# EAGLE design main (EAGLE 5.09)
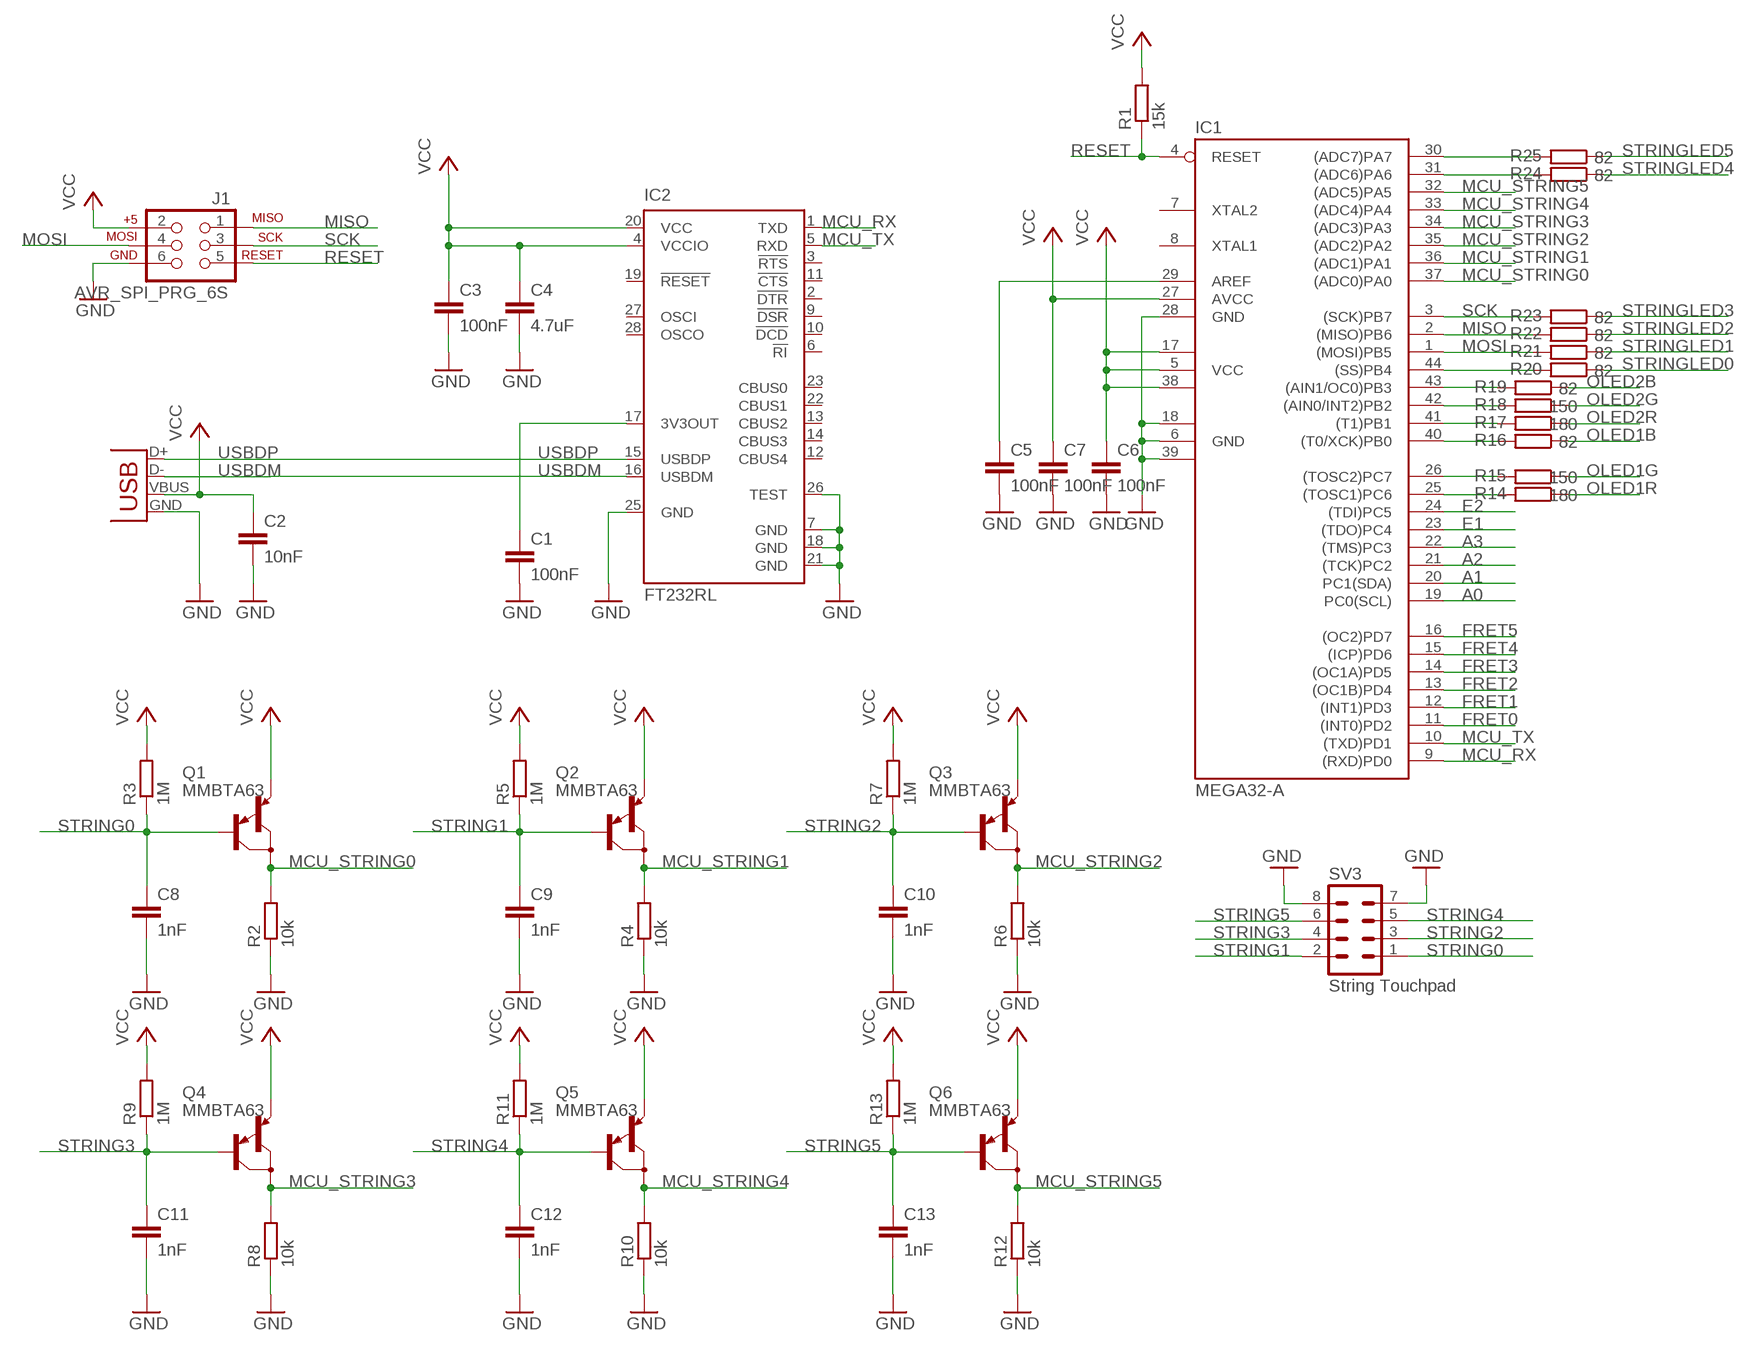
[diagram p0: schematic, sheet 1, part 1 of 2]
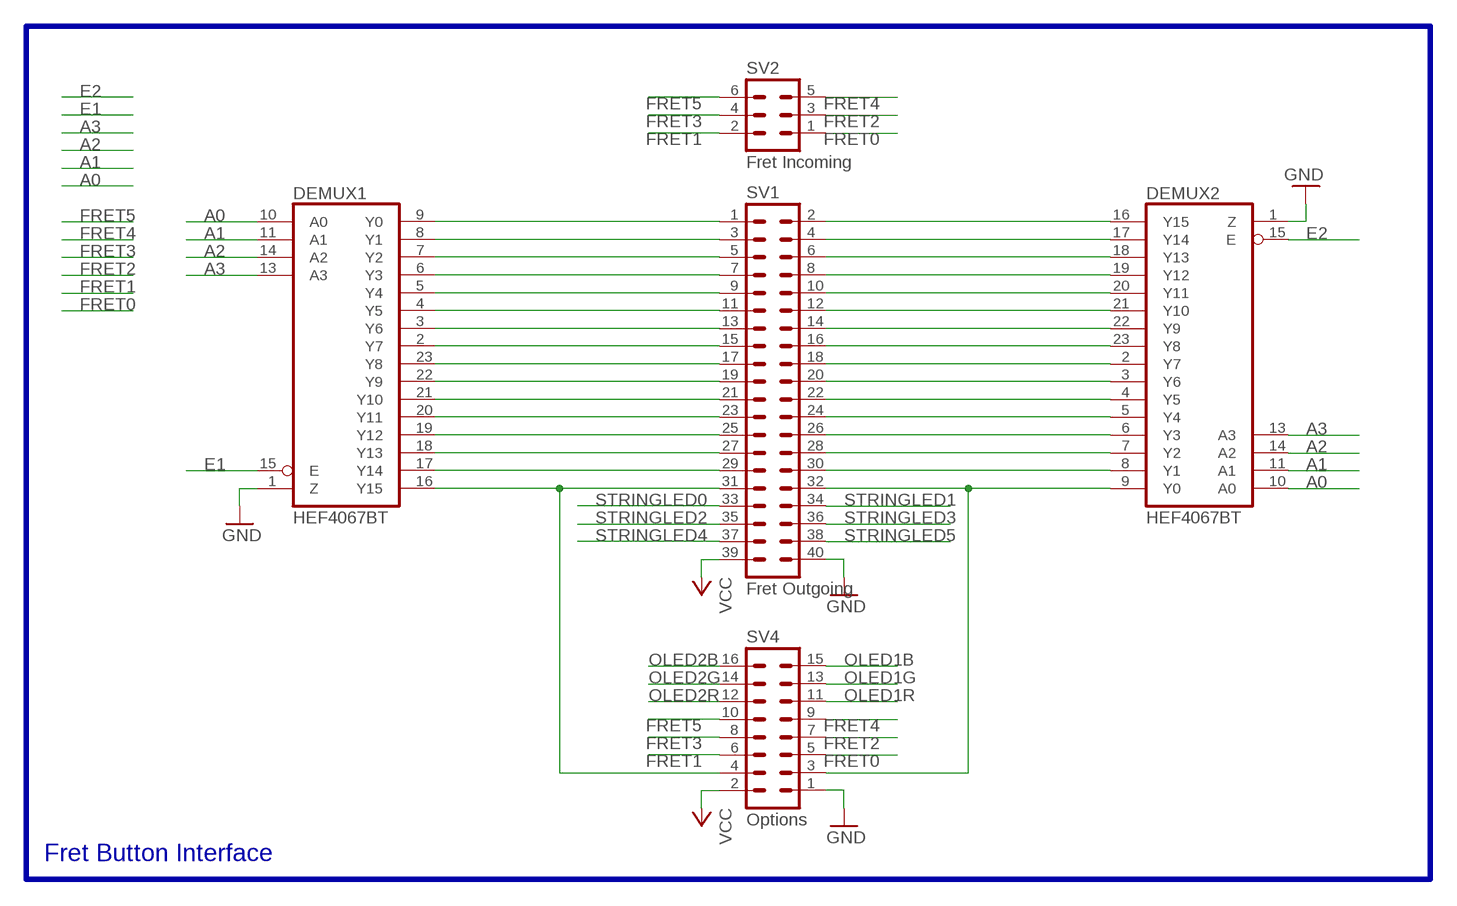
[diagram p1: schematic, sheet 1, part 2 of 2]

## Parts
C1  100nF  C-EUC0805  [C0805]
C2  10nF  C-EUC0805  [C0805]
C3  100nF  C-EUC0805  [C0805]
C4  4.7uF  C-EUC0805  [C0805]
C5  100nF  C-EUC0805  [C0805]
C6  100nF  C-EUC0805  [C0805]
C7  100nF  C-EUC0805  [C0805]
C8  1nF  C-EUC0805  [C0805]
C9  1nF  C-EUC0805  [C0805]
C10  1nF  C-EUC0805  [C0805]
C11  1nF  C-EUC0805  [C0805]
C12  1nF  C-EUC0805  [C0805]
C13  1nF  C-EUC0805  [C0805]
DEMUX1  HEF4067BT  [SO24W]
DEMUX2  HEF4067BT  [SO24W]
IC1  MEGA32-A  [TQFP44]
IC2  FT232RL  [SSOP28]
J1  AVR_SPI_PRG_6S  [MA03-2]
Q1  MMBTA63  MMBTA64LT1SOT23-BEC  [SOT23-BEC]
Q2  MMBTA63  MMBTA64LT1SOT23-BEC  [SOT23-BEC]
Q3  MMBTA63  MMBTA64LT1SOT23-BEC  [SOT23-BEC]
Q4  MMBTA63  MMBTA64LT1SOT23-BEC  [SOT23-BEC]
Q5  MMBTA63  MMBTA64LT1SOT23-BEC  [SOT23-BEC]
Q6  MMBTA63  MMBTA64LT1SOT23-BEC  [SOT23-BEC]
R1  15k  R-EU_R0805  [R0805]
R2  10k  R-EU_R0805  [R0805]
R3  1M  R-EU_R0805  [R0805]
R4  10k  R-EU_R0805  [R0805]
R5  1M  R-EU_R0805  [R0805]
R6  10k  R-EU_R0805  [R0805]
R7  1M  R-EU_R0805  [R0805]
R8  10k  R-EU_R0805  [R0805]
R9  1M  R-EU_R0805  [R0805]
R10  10k  R-EU_R0805  [R0805]
R11  1M  R-EU_R0805  [R0805]
R12  10k  R-EU_R0805  [R0805]
R13  1M  R-EU_R0805  [R0805]
R14  180  R-EU_R0805  [R0805]
R15  150  R-EU_R0805  [R0805]
R16  82  R-EU_R0805  [R0805]
R17  180  R-EU_R0805  [R0805]
R18  150  R-EU_R0805  [R0805]
R19  82  R-EU_R0805  [R0805]
R20  82  R-EU_R0805  [R0805]
R21  82  R-EU_R0805  [R0805]
R22  82  R-EU_R0805  [R0805]
R23  82  R-EU_R0805  [R0805]
R24  82  R-EU_R0805  [R0805]
R25  82  R-EU_R0805  [R0805]
SV1  Fret Outgoing  MA20-2  [MA20-2]
SV2  Fret Incoming  MA03-2  [MA03-2]
SV3  String Touchpad  MA04-2  [MA04-2]
SV4  Options  MA08-2  [MA08-2]
X1  USBPTH  [USB-B-PTH]

## Nets
A0: DEMUX1.10(A0) DEMUX2.10(A0) IC1.19(PC0(SCL))
A1: DEMUX1.11(A1) DEMUX2.11(A1) IC1.20(PC1(SDA))
A2: DEMUX1.14(A2) DEMUX2.14(A2) IC1.21((TCK)PC2)
A3: DEMUX1.13(A3) DEMUX2.13(A3) IC1.22((TMS)PC3)
E1: DEMUX1.15(E) IC1.23((TDO)PC4)
E2: DEMUX2.15(E) IC1.24((TDI)PC5)
FRET0: IC1.11((INT0)PD2) SV2.1 SV4.5
FRET1: IC1.12((INT1)PD3) SV2.2 SV4.6
FRET2: IC1.13((OC1B)PD4) SV2.3 SV4.7
FRET3: IC1.14((OC1A)PD5) SV2.4 SV4.8
FRET4: IC1.15((ICP)PD6) SV2.5 SV4.9
FRET5: IC1.16((OC2)PD7) SV2.6 SV4.10
GND: C1.2 C2.2 C3.2 C4.2 C5.2 C6.2 C7.2 C8.2 C9.2 C10.2 C11.2 C12.2 C13.2 DEMUX1.1(Z) DEMUX2.1(Z) IC1.6(GND) IC1.18(GND1) IC1.28(GND) IC1.39(GND2) IC2.7(GND) IC2.18(GND) IC2.21(GND) IC2.25(GND) IC2.26(TEST) J1.6 R2.1 R4.1 R6.1 R8.1 R10.1 R12.1 SV1.40 SV3.7 SV3.8 SV4.1 X1.GND
MCU_RX: IC1.9((RXD)PD0) IC2.1(TXD)
MCU_STRING0: IC1.37((ADC0)PA0) Q1.C R2.2
MCU_STRING1: IC1.36((ADC1)PA1) Q2.C R4.2
MCU_STRING2: IC1.35((ADC2)PA2) Q3.C R6.2
MCU_STRING3: IC1.34((ADC3)PA3) Q4.C R8.2
MCU_STRING4: IC1.33((ADC4)PA4) Q5.C R10.2
MCU_STRING5: IC1.32((ADC5)PA5) Q6.C R12.2
MCU_TX: IC1.10((TXD)PD1) IC2.5(RXD)
MISO: IC1.2((MISO)PB6) J1.1 R22.2
MOSI: IC1.1((MOSI)PB5) J1.4 R21.2
N$1: C5.1 IC1.29(AREF)
N$2: DEMUX1.9(Y0) SV1.1
N$3: C1.1 IC2.17(3V3OUT)
N$4: DEMUX1.8(Y1) SV1.3
N$5: DEMUX1.7(Y2) SV1.5
N$6: DEMUX1.6(Y3) SV1.7
N$7: DEMUX1.5(Y4) SV1.9
N$8: DEMUX1.4(Y5) SV1.11
N$9: DEMUX1.3(Y6) SV1.13
N$10: DEMUX1.2(Y7) SV1.15
N$11: DEMUX1.23(Y8) SV1.17
N$12: DEMUX1.22(Y9) SV1.19
N$13: DEMUX1.21(Y10) SV1.21
N$14: DEMUX1.20(Y11) SV1.23
N$15: DEMUX1.19(Y12) SV1.25
N$16: DEMUX1.18(Y13) SV1.27
N$17: DEMUX1.17(Y14) SV1.29
N$18: DEMUX1.16(Y15) SV1.31 SV4.4
N$19: DEMUX2.9(Y0) SV1.32 SV4.3
N$20: DEMUX2.8(Y1) SV1.30
N$21: DEMUX2.7(Y2) SV1.28
N$22: DEMUX2.6(Y3) SV1.26
N$23: DEMUX2.5(Y4) SV1.24
N$24: DEMUX2.4(Y5) SV1.22
N$25: DEMUX2.3(Y6) SV1.20
N$26: DEMUX2.2(Y7) SV1.18
N$27: DEMUX2.23(Y8) SV1.16
N$28: DEMUX2.22(Y9) SV1.14
N$29: DEMUX2.21(Y10) SV1.12
N$30: DEMUX2.20(Y11) SV1.10
N$31: DEMUX2.19(Y12) SV1.8
N$32: DEMUX2.18(Y13) SV1.6
N$33: DEMUX2.17(Y14) SV1.4
N$34: DEMUX2.16(Y15) SV1.2
N$35: IC1.38(VCC2)
N$36: IC1.43((AIN1/OC0)PB3) R19.2
N$37: IC1.42((AIN0/INT2)PB2) R18.2
N$38: IC1.41((T1)PB1) R17.2
N$39: IC1.40((T0/XCK)PB0) R16.2
N$40: IC1.26((TOSC2)PC7) R15.2
N$41: IC1.25((TOSC1)PC6) R14.2
N$44: IC1.44((SS)PB4) R20.2
N$53: IC1.31((ADC6)PA6) R24.2
N$54: IC1.30((ADC7)PA7) R25.2
OLED1B: R16.1 SV4.15
OLED1G: R15.1 SV4.13
OLED1R: R14.1 SV4.11
OLED2B: R19.1 SV4.16
OLED2G: R18.1 SV4.14
OLED2R: R17.1 SV4.12
RESET: IC1.4(RESET) J1.5 R1.1
SCK: IC1.3((SCK)PB7) J1.3 R23.2
STRING0: C8.1 Q1.B R3.1 SV3.1
STRING1: C9.1 Q2.B R5.1 SV3.2
STRING2: C10.1 Q3.B R7.1 SV3.3
STRING3: C11.1 Q4.B R9.1 SV3.4
STRING4: C12.1 Q5.B R11.1 SV3.5
STRING5: C13.1 Q6.B R13.1 SV3.6
STRINGLED0: R20.1 SV1.33
STRINGLED1: R21.1 SV1.34
STRINGLED2: R22.1 SV1.35
STRINGLED3: R23.1 SV1.36
STRINGLED4: R24.1 SV1.37
STRINGLED5: R25.1 SV1.38
USBDM: IC2.16(USBDM) X1.D-
USBDP: IC2.15(USBDP) X1.D+
VCC: C2.1 C3.1 C4.1 C6.1 C7.1 IC1.5(VCC) IC1.17(VCC1) IC1.27(AVCC) IC2.4(VCCIO) IC2.20(VCC) J1.2 Q1.E Q2.E Q3.E Q4.E Q5.E Q6.E R1.2 R3.2 R5.2 R7.2 R9.2 R11.2 R13.2 SV1.39 SV4.2 X1.VBUS
Unconnected: IC1.7(XTAL2) IC1.8(XTAL1) IC2.2(!DTR) IC2.3(!RTS) IC2.6(!RI) IC2.9(!DSR) IC2.10(!DCD) IC2.11(!CTS) IC2.12(CBUS4) IC2.13(CBUS2) IC2.14(CBUS3) IC2.19(!RESET) IC2.22(CBUS1) IC2.23(CBUS0) IC2.27(OSCI) IC2.28(OSCO)

## Buses
B$1

## Notes on the sheet
- Fret Button Interface

## Power pins joined to a net without a drawn wire
GND: DEMUX1.12(GND) DEMUX2.12(GND)
VCC: DEMUX1.24(VCC) DEMUX2.24(VCC)

## Library data of the parts
C1-C13 = rcl:C-EU: CAPACITOR, European symbol
DEMUX1 DEMUX2 = HyperTriangle:HEF4067B: 4-line to 16-channel analogue multiplexer/demultiplexer
IC1 = atmel:MEGA32: MICROCONTROLLER 32 Kbytes FLASH 2 Kbytes SRAM 1 Kbytes EEPROM USART 8-channel 10 bit ADC Source: www.atmel.com .. doc2503.pdf
IC2 = ftdichip:FT232R: Source: http://www.ftdichip.com/Documents/DataSheets/DS_FT232R_v104.pdf
J1 = SparkFun:AVR_SPI_PRG_6: AVR ISP 6 Pin This is the reduced ISP connector for AVR programming. Common on Arduino. This footprint will take up less PCB space and can be used with a 10-pin to 6-pin adapter such as SKU: BOB-08508
Q1-Q6 = transistor-pnp:MMBTA64*: PNP Darlington Transistor
R1-R25 = rcl:R-EU_: RESISTOR, European symbol
SV1 = con-lstb:MA20-2: PIN HEADER
SV2 = con-lstb:MA03-2: PIN HEADER
SV3 = con-lstb:MA04-2: PIN HEADER
SV4 = con-lstb:MA08-2: PIN HEADER
X1 = SparkFun:USB: USB Connectors USB-B-PTH is fully proven SKU : PRT-00139 USB-miniB is fully proven SKU : PRT-00587 USB-A-PCB is untested. USB-A-H is throughly reviewed, but untested. Spark Fun Electronics SKU : PRT-00437 USB-B-SMT is throughly reviewed, but untested. Needs silkscreen touching up. USB-A-S has not been used/tested USB-MB-H has not been used/tested

## Board
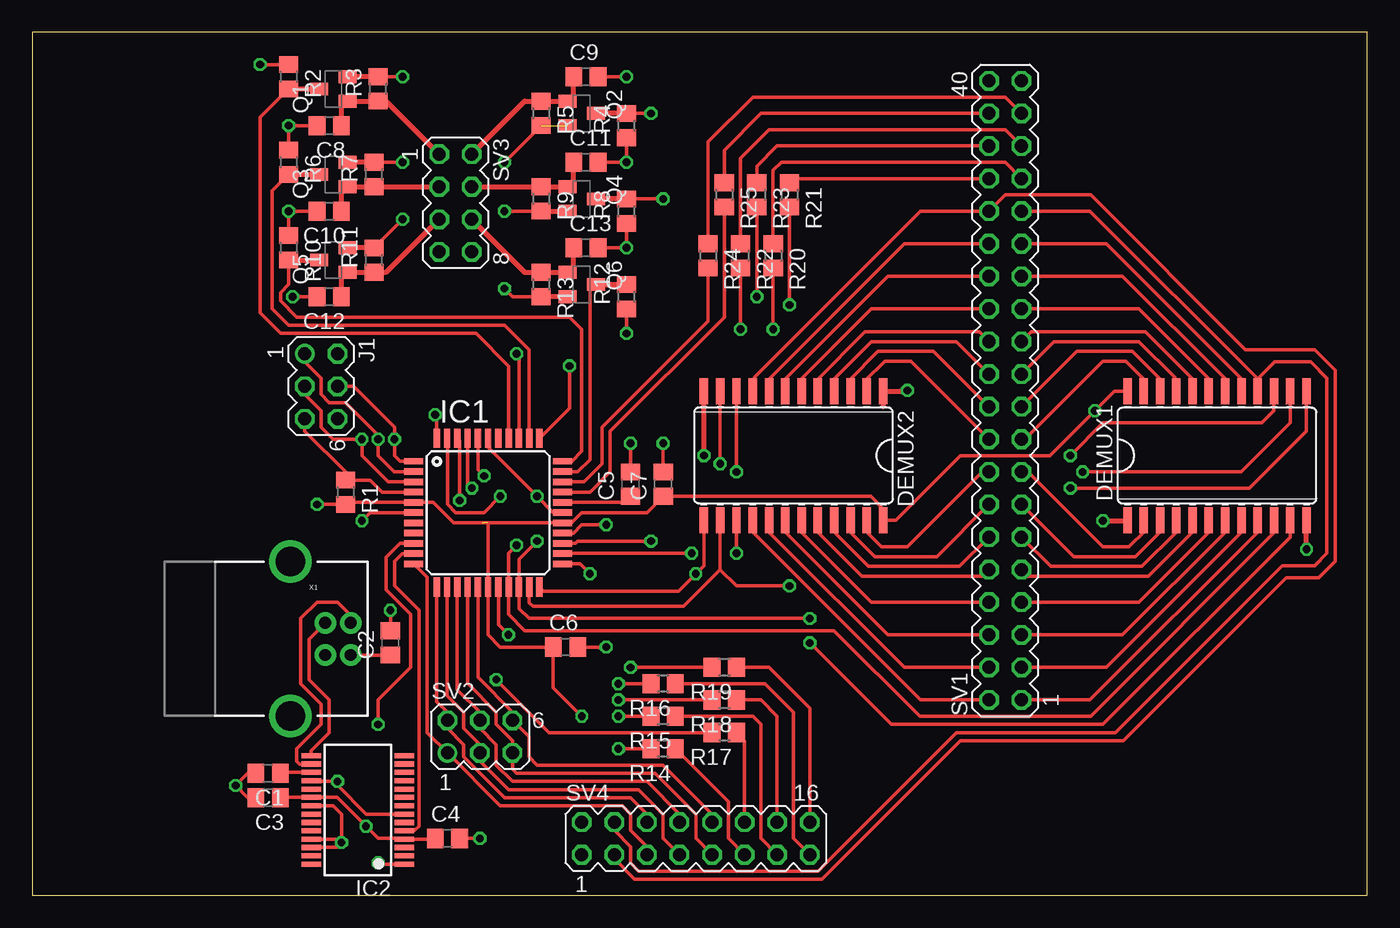
[diagram p2: board, top side]
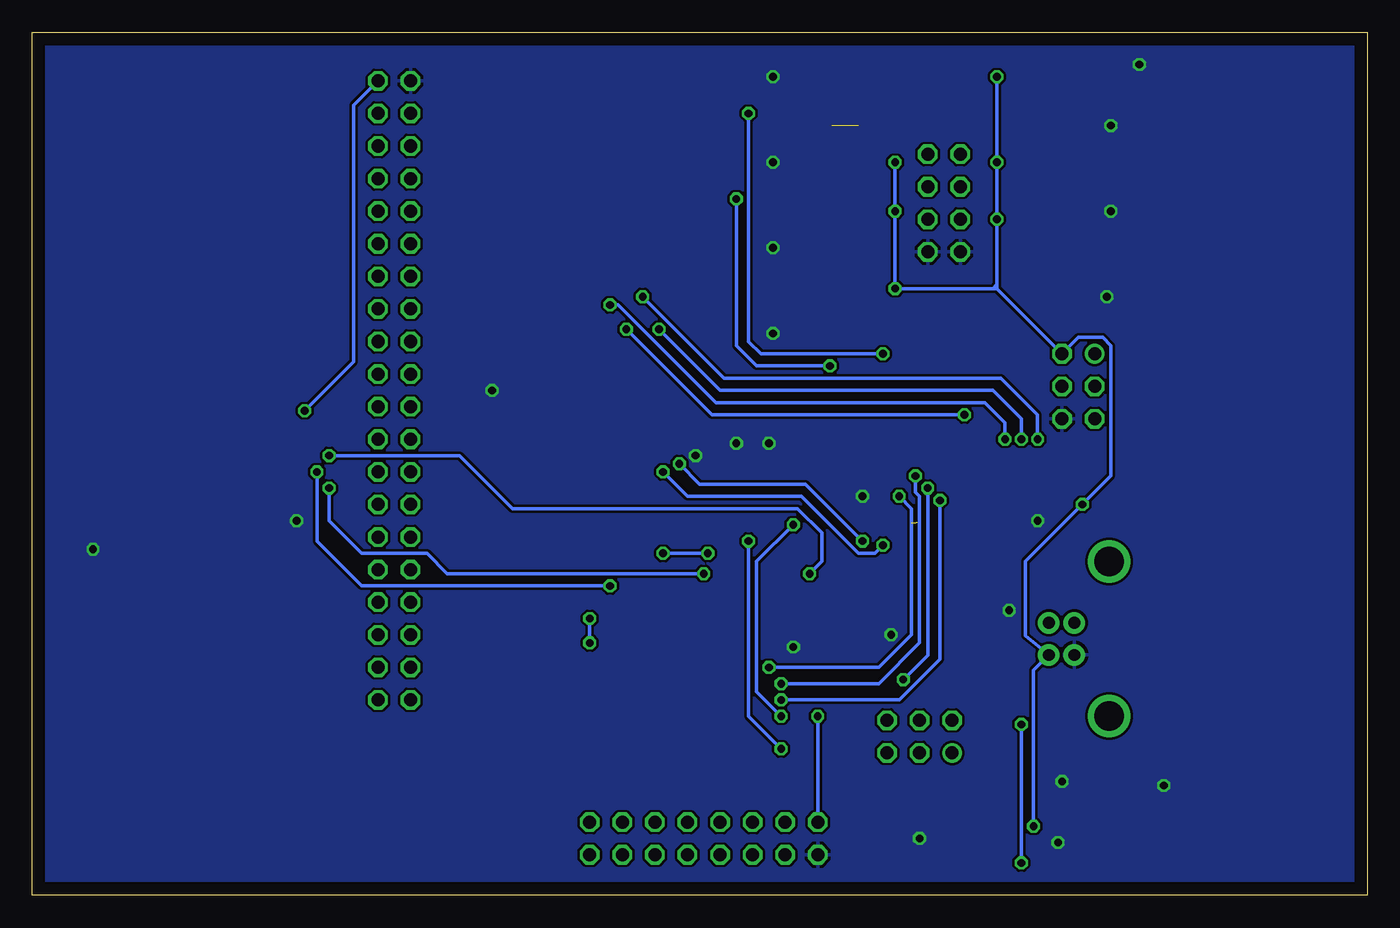
[diagram p3: board, bottom side, seen from below]

Size 104.13 x 67.3 mm. Coordinates in mm from the lower left corner, seen from the top.
Outline: 0,0 104.13,0 104.13,67.3 0,67.3 0,0
Copper layers (1*16): Top 0.035mm / dielectric 1.5mm / Bottom 0.035mm
Design rules "default *": minimum track width 10mil, minimum drill 24mil, track to track 8mil, track to pad 8mil, pad to pad 8mil, via to via 8mil, smd to smd 8mil, copper to edge 40mil, drill to drill 8mil, minimum pad ring 10mil, minimum via ring 8mil, stop-mask expansion 4mil, vias tented up to drill 0mil, thermal gap 10mil

### Footprints (pad centres in the part's own frame; a part is rotated, then mirrored left to right if it is on the bottom)
C0805 = smd 1.3 x 1.5: 1 -0.95,0; 2 0.95,0
SO24W = smd 0.66 x 2.032: 1 -6.985,-5.029; 2 -5.715,-5.029; 3 -4.445,-5.029; 4 -3.175,-5.029; 5 -1.905,-5.029; 6 -0.635,-5.029; 7 0.635,-5.029; 8 1.905,-5.029; 9 3.175,-5.029; 10 4.445,-5.029; 11 5.715,-5.029; 12 6.985,-5.029; 13 6.985,5.029; 14 5.715,5.029; 15 4.445,5.029; 16 3.175,5.029; 17 1.905,5.029; 18 0.635,5.029; 19 -0.635,5.029; 20 -1.905,5.029; 21 -3.175,5.029; 22 -4.445,5.029; 23 -5.715,5.029; 24 -6.985,5.029
TQFP44 = smd 1.5 x 0.5: 1 -5.8,4; 2 -5.8,3.2; 3 -5.8,2.4; 4 -5.8,1.6; 5 -5.8,0.8; 6 -5.8,0; 7 -5.8,-0.8; 8 -5.8,-1.6; 9 -5.8,-2.4; 10 -5.8,-3.2; 11 -5.8,-4; 23 5.8,-4; 24 5.8,-3.2; 25 5.8,-2.4; 26 5.8,-1.6; 27 5.8,-0.8; 28 5.8,0; 29 5.8,0.8; 30 5.8,1.6; 31 5.8,2.4; 32 5.8,3.2; 33 5.8,4 | smd 0.5 x 1.5: 12 -4,-5.8; 13 -3.2,-5.8; 14 -2.4,-5.8; 15 -1.6,-5.8; 16 -0.8,-5.8; 17 0,-5.8; 18 0.8,-5.8; 19 1.6,-5.8; 20 2.4,-5.8; 21 3.2,-5.8; 22 4,-5.8; 34 4,5.8; 35 3.2,5.8; 36 2.4,5.8; 37 1.6,5.8; 38 0.8,5.8; 39 0,5.8; 40 -0.8,5.8; 41 -1.6,5.8; 42 -2.4,5.8; 43 -3.2,5.8; 44 -4,5.8
SSOP28 = smd 0.4 x 1.5: 1 -4.225,-3.625; 2 -3.575,-3.625; 3 -2.925,-3.625; 4 -2.275,-3.625; 5 -1.625,-3.625; 6 -0.975,-3.625; 7 -0.325,-3.625; 8 0.325,-3.625; 9 0.975,-3.625; 10 1.625,-3.625; 11 2.275,-3.625; 12 2.925,-3.625; 13 3.575,-3.625; 14 4.225,-3.625; 15 4.225,3.625; 16 3.575,3.625; 17 2.925,3.625; 18 2.275,3.625; 19 1.625,3.625; 20 0.975,3.625; 21 0.325,3.625; 22 -0.325,3.625; 23 -0.975,3.625; 24 -1.625,3.625; 25 -2.275,3.625; 26 -2.925,3.625; 27 -3.575,3.625; 28 -4.225,3.625
MA03-2 = drill 1.016 round: 1 -2.54,-1.27 | drill 1.016 octagon: 2 -2.54,1.27; 3 0,-1.27; 4 0,1.27; 5 2.54,-1.27; 6 2.54,1.27
SOT23-BEC = smd 1 x 1.4: B -0.95,-1.1; C 0,1.1; E 0.95,-1.1
R0805 = smd 1.3 x 1.5: 1 -0.95,0; 2 0.95,0
MA20-2 = drill 1.016 octagon: 1 -24.13,-1.27; 2 -24.13,1.27; 3 -21.59,-1.27; 4 -21.59,1.27; 5 -19.05,-1.27; 6 -19.05,1.27; 7 -16.51,-1.27; 8 -16.51,1.27; 9 -13.97,-1.27; 10 -13.97,1.27; 11 -11.43,-1.27; 12 -11.43,1.27; 13 -8.89,-1.27; 14 -8.89,1.27; 15 -6.35,-1.27; 16 -6.35,1.27; 17 -3.81,-1.27; 18 -3.81,1.27; 19 -1.27,-1.27; 20 -1.27,1.27; 21 1.27,-1.27; 22 1.27,1.27; 23 3.81,-1.27; 24 3.81,1.27; 25 6.35,-1.27; 26 6.35,1.27; 27 8.89,-1.27; 28 8.89,1.27; 29 11.43,-1.27; 30 11.43,1.27; 31 13.97,-1.27; 32 13.97,1.27; 33 16.51,-1.27; 34 16.51,1.27; 35 19.05,-1.27; 36 19.05,1.27; 37 21.59,-1.27; 38 21.59,1.27; 39 24.13,-1.27; 40 24.13,1.27
MA04-2 = drill 1.016 octagon: 1 -3.81,-1.27; 2 -3.81,1.27; 3 -1.27,-1.27; 4 -1.27,1.27; 5 1.27,-1.27; 6 1.27,1.27; 7 3.81,-1.27; 8 3.81,1.27
MA08-2 = drill 1.016 octagon: 1 -8.89,-1.27; 2 -8.89,1.27; 3 -6.35,-1.27; 4 -6.35,1.27; 5 -3.81,-1.27; 6 -3.81,1.27; 7 -1.27,-1.27; 8 -1.27,1.27; 9 1.27,-1.27; 10 1.27,1.27; 11 3.81,-1.27; 12 3.81,1.27; 13 6.35,-1.27; 14 6.35,1.27; 15 8.89,-1.27; 16 8.89,1.27
USB-B-PTH = drill 0.914 pad 1.676 round: D+ 0,1.25; D- 1.981,1.25; GND 0,-1.25; VBUS 1.981,-1.25 | drill 2.286 round: P$1 -2.718,-6.02; P$2 -2.718,6.02

### Placement (x,y rotation side)
C1  18.41,9.53 180 top
C2  27.94,19.68 90 top
C3  18.41,7.62 180 top
C4  32.38,4.45 0 top
C5  46.67,32.07 90 top
C6  41.59,19.37 0 top
C7  49.21,32.07 90 top
C8  23.18,60.01 180 top
C9  43.18,63.82 0 top
C10  23.18,53.34 180 top
C11  43.18,57.15 0 top
C12  23.18,46.67 180 top
C13  43.18,50.48 0 top
DEMUX1  92.39,34.29 0 top
DEMUX2  59.37,34.29 180 top
IC1  35.56,29.84 0 top
IC2  25.4,6.67 90 top
J1  22.54,39.69 270 top
Q1  23.5,62.87 90 top
Q2  42.86,60.96 270 top
Q3  23.5,56.2 90 top
Q4  42.86,54.29 270 top
Q5  23.5,49.53 90 top
Q6  42.86,47.62 270 top
R1  24.45,31.43 270 top
R2  20,63.82 270 top
R3  26.99,62.87 90 top
R4  46.35,60.01 90 top
R5  39.69,60.96 270 top
R6  20,57.15 270 top
R7  26.67,56.2 90 top
R8  46.35,53.34 90 top
R9  39.69,54.29 270 top
R10  20,50.48 270 top
R11  26.67,49.53 90 top
R12  46.35,46.67 90 top
R13  39.69,47.62 270 top
R14  49.21,11.43 180 top
R15  49.21,13.97 180 top
R16  49.21,16.51 180 top
R17  53.98,12.7 180 top
R18  53.98,15.24 180 top
R19  53.98,17.78 180 top
R20  57.78,49.85 270 top
R21  59.05,54.61 270 top
R22  55.24,49.85 270 top
R23  56.52,54.61 270 top
R24  52.7,49.85 270 top
R25  53.98,54.61 270 top
SV1  75.88,39.37 90 top
SV2  34.92,12.38 0 top
SV3  33.02,53.98 270 top
SV4  51.75,4.45 0 top
X1  22.86,20 0 top

### Tracks (layer width: path | path; a pad name or v marks a point on that pad's centre or on a via)
A0  (via drill 0.6)
  Top 0.254: DEMUX1.10 96.84,28.26 82.55,13.97 69.22,13.97 62.55,20.64 38.42,20.64 37.15,21.91 37.15,24.03 IC1.19 | IC1.19 37.15,24.06 | v54.93,33.02 DEMUX2.10 | IC1.19 37.16,26.68 v37.78,27.3
  Bottom 0.254: v54.93,33.02 53.02,31.11 44.13,31.11 39.69,26.67 38.42,26.67 v37.78,27.3
A1  (via drill 0.6)
  Top 0.254: DEMUX1.11 98.11,27.94 83.5,13.34 66.99,13.34 v60.64,19.68 | 37.96,23.5 37.96,22.36 38.73,21.59 v60.64,21.59 | 37.96,23.5 IC1.20 37.96,26.21 v39.37,27.62 | 37.96,23.5 38.1,23.64 | v53.66,33.66 DEMUX2.11
  Bottom 0.254: v39.37,27.62 43.81,32.07 52.07,32.07 v53.66,33.66 | v60.64,21.59 v60.64,19.68
A2  (via drill 0.6)
  Top 0.254: IC1.21 38.76,22.84 39.05,22.54 50.8,22.54 53.66,25.4 | v81.92,33.02 94.3,33.02 98.11,36.83 DEMUX1.14 | v59.05,24.13 54.93,24.13 53.66,25.4 | 53.66,25.4 DEMUX2.14
  Bottom 0.254: v81.92,33.02 81.92,27.62 78.42,24.13 v59.05,24.13
A3  (via drill 0.6)
  Top 0.254: DEMUX2.13 52.39,25.72 v51.75,25.08 50.4,23.73 39.88,23.73 IC1.22 39.56,23.73 | DEMUX1.13 99.38,36.2 94.93,31.75 v80.96,31.75
  Bottom 0.254: v80.96,31.75 80.96,29.21 78.42,26.67 73.34,26.67 71.75,25.08 v51.75,25.08
E1  (via drill 0.6)
  Top 0.254: DEMUX1.15 96.84,37.78 95.89,36.83 83.5,36.83 v80.96,34.29 | v43.5,25.08 42.73,25.84 IC1.23
  Bottom 0.254: v80.96,34.29 70.8,34.29 66.67,30.16 44.45,30.16 42.55,28.26 42.55,26.04 v43.5,25.08
E2  (via drill 0.6)
  Top 0.254: v54.93,26.67 DEMUX2.15 | IC1.24 41.38,26.67 v51.44,26.67
  Bottom 0.254: v51.44,26.67 v54.93,26.67
FRET0
  Top 0.254: SV4.5 47.94,3.81 46.67,5.08 46.67,6.35 46.04,6.99 36.51,6.99 SV2.1 30.8,12.7 30.8,24.81 IC1.11
FRET1
  Top 0.254: SV4.6 47.94,6.35 46.67,7.62 36.83,7.62 33.66,10.79 33.66,11.75 32.38,13.02 SV2.2 32.38,14.29 31.56,15.11 IC1.12
FRET2
  Top 0.254: SV4.7 49.21,4.45 49.21,6.35 47.31,8.26 37.15,8.26 34.92,10.48 SV2.3 34.92,11.75 33.66,13.02 33.66,14.29 32.36,15.58 IC1.13 32.38,24.02
FRET3
  Top 0.254: SV4.8 50.48,6.35 47.94,8.89 37.47,8.89 36.2,10.16 36.2,11.75 34.92,13.02 SV2.4 34.92,14.29 33.16,16.05 IC1.14
FRET4
  Top 0.254: SV4.9 51.75,4.45 51.75,6.35 48.58,9.53 37.78,9.53 37.47,9.84 SV2.5 37.47,12.06 36.2,13.34 36.2,14.29 33.96,16.52 IC1.15 33.97,24.03
FRET5
  Top 0.254: SV4.10 53.02,6.35 49.21,10.16 39.37,10.16 38.73,10.79 38.73,12.38 SV2.6 37.47,14.29 34.76,16.99 IC1.16
GND  (via drill 0.6)
  Top 0.254: C4.2 v34.92,4.45 | IC1.18 36.36,21.11 v37.15,20.32 | C6.2 v44.77,19.37 | C5.2 v46.67,35.24 | C7.2 v49.21,35.24 49.28,35.31 | IC1.39 35.56,34.92 v39.37,31.11 40.64,29.84 IC1.28 | SV3.7 31.75,50.29 | SV3.8 34.29,50.29 | R2.1 v17.78,64.77 | C8.2 v20,60.01 R6.1 | C10.2 v20,53.34 R10.1 | C13.2 v46.35,50.48 R8.1 | v46.35,43.81 R12.1 | C11.2 v46.35,57.15 R4.1 | C9.2 v46.35,63.82 | IC1.6 26.35,29.84 v25.72,29.21 | C12.2 v20.32,46.67 | C2.2 v27.94,22.23 | IC2.18 21.83,8.89 v23.81,8.89 23.81,8.57 26.04,6.34 IC2.7 | IC2.21 23.49,6.99 24.13,6.35 v24.13,4.13 | v24.13,4.13 23.86,4.39 IC2.25 | IC2.26 23.75,3.74 v24.13,4.13 | C1.2 16.83,9.53 v15.88,8.57 16.83,7.62 C3.2
  Top 0.406: 66.36,38.1 DEMUX2.1 68.26,39.32 v68.26,39.37 | v83.5,29.21 85.41,29.21 DEMUX1.1 | v52.39,34.29 DEMUX2.12 | v99.38,26.99 DEMUX1.12 | C8.2 21.91,59.69 | C10.2 21.91,53.02
  Bottom 0.254: 68.07,39.37 v68.26,39.37 68.33,39.37 | 74.42,63.5 SV1.40 74.68,63.5
  pour Bottom: 0,67.31 0,0 104.14,0 104.14,67.31
MCU_RX  (via drill 0.6)
  Top 0.254: 29.02,2.41 IC2.1 27.09,2.44 v26.99,2.54 | v26.99,13.34 26.99,15.24 29.53,17.78 29.53,21.91 27.62,23.81 27.62,26.35 28.71,27.45 IC1.9
  Bottom 0.254: v26.99,2.54 v26.99,13.34
MCU_STRING0
  Top 0.254: IC1.37 37.16,41.26 34.61,43.81 19.37,43.81 17.78,45.4 17.78,60.65 R2.2
  Top 0.406: R2.2 Q1.C
MCU_STRING1  (via drill 0.6)
  Top 0.254: v48.26,60.96 R4.2 | IC1.36 37.96,42.05 v37.78,42.23
  Top 0.406: R4.2 Q2.C
  Bottom 0.254: v37.78,42.23 47.31,42.23 48.26,43.18 v48.26,60.96
MCU_STRING2
  Top 0.254: IC1.35 38.76,42.52 36.83,44.45 20,44.45 18.73,45.72 18.73,54.93 R6.2
  Top 0.406: R6.2 Q3.C
MCU_STRING3  (via drill 0.6)
  Top 0.254: IC1.34 41.91,37.99 v41.91,41.27 | v49.21,54.29 R8.2
  Top 0.406: R8.2 Q4.C
  Bottom 0.254: v41.91,41.27 47.62,41.27 49.21,42.86 v49.21,54.29
MCU_STRING4
  Top 0.254: R10.2 20,47.62 19.37,46.99 19.37,46.35 20.64,45.09 41.91,45.09 42.86,44.13 42.86,34.61 42.1,33.84 IC1.33
  Top 0.406: R10.2 Q5.C
MCU_STRING5
  Top 0.254: 43.82,47.62 43.5,47.3 43.5,33.97 42.55,33.02 41.38,33.02 IC1.32
  Top 0.406: Q6.C R12.2 43.82,47.62 43.81,47.62
MCU_TX
  Top 0.254: IC1.10 28.87,26.64 28.26,26.04 28.26,24.13 30.16,22.23 30.16,5.4 29.84,5.08 29.06,5.08 IC2.5
MISO  (via drill 0.6)
  Top 0.254: 29.73,33.02 IC1.2 28.23,33.05 26.99,34.29 v26.99,35.56 26.99,35.88 24.45,38.42 23.18,38.42 22.54,39.05 22.54,40.32 21.27,41.59 J1.1 | v55.24,44.13 R22.2
  Bottom 0.254: v55.24,44.13 50.48,39.37 29.21,39.37 26.99,37.15 v26.99,35.56
MOSI  (via drill 0.6)
  Top 0.254: v59.05,46.04 R21.2 | J1.4 25.08,39.69 28.26,36.51 v28.26,35.56 28.26,34.29 28.7,33.84 IC1.1
  Bottom 0.254: v59.05,46.04 58.42,46.04 50.8,38.42 29.84,38.42 28.26,36.83 v28.26,35.56
N$1
  Top 0.254: C5.1 46.2,30.64 IC1.29
N$2
  Top 0.254: SV1.1 82.49,15.24 95.69,28.45 95.69,29.13 DEMUX1.9
N$3
  Top 0.254: IC2.17 19.43,9.59 C1.1
N$4
  Top 0.254: DEMUX1.8 94.3,28.32 83.76,17.78 SV1.3
N$5
  Top 0.254: DEMUX1.7 93.03,28.32 85.03,20.32 SV1.5
N$6
  Top 0.254: DEMUX1.6 91.76,28.32 86.3,22.86 SV1.7
N$7
  Top 0.254: DEMUX1.5 90.49,28.32 87.06,24.89 77.66,24.89 SV1.9
N$8
  Top 0.254: DEMUX1.4 89.22,28.32 86.55,25.65 79.44,25.65 SV1.11
N$9
  Top 0.254: DEMUX1.3 87.95,28.32 86.04,26.42 81.22,26.42 SV1.13
N$10
  Top 0.254: SV1.15 77.66,33.02 83.5,27.18 85.53,27.18 86.81,28.45 86.81,29.13 DEMUX1.2
N$11
  Top 0.254: SV1.17 77.41,35.56 83.5,41.66 85.28,41.66 86.81,40.13 86.81,39.45 DEMUX1.23
N$12
  Top 0.254: DEMUX1.22 87.95,40.26 85.79,42.42 81.47,42.42 SV1.19
N$13
  Top 0.254: DEMUX1.21 89.22,39.24 89.09,39.12 89.09,40.39 86.3,43.18 79.69,43.18 SV1.21
N$14
  Top 0.254: DEMUX1.20 90.49,40.26 86.81,43.94 77.92,43.94 SV1.23
N$15
  Top 0.254: DEMUX1.19 91.76,40.26 86.3,45.72 SV1.25
N$16
  Top 0.254: DEMUX1.18 93.03,40.26 85.03,48.26 SV1.27
N$17
  Top 0.254: DEMUX1.17 94.3,40.26 83.76,50.8 SV1.29
N$18
  Top 0.254: 95.57,40.26 DEMUX1.16 | 95.57,40.26 82.49,53.34 SV1.31 | SV4.4 45.4,5.08 46.67,3.81 46.67,2.54 47.31,1.91 61.28,1.91 72.07,12.7 84.45,12.7 97.47,25.72 100.01,25.72 100.97,26.67 100.97,40.32 99.69,41.59 96.9,41.59 95.57,40.26
N$19
  Top 0.254: DEMUX2.9 56.33,39.45 56.33,40.39 69.28,53.34 SV1.32 75.88,54.61 82.55,54.61 94.61,42.55 100.01,42.55 101.6,40.96 101.6,26.04 100.33,24.77 97.79,24.77 85.09,12.06 72.39,12.06 61.59,1.27 46.99,1.27 45.4,2.86 SV4.3
N$20
  Top 0.254: SV1.30 68.01,50.8 57.34,40.13
  Top 0.406: 57.34,40.13 57.47,40.13 DEMUX2.8
N$21
  Top 0.254: DEMUX2.7 58.74,40.26 66.74,48.26 SV1.28
N$22
  Top 0.254: DEMUX2.6 60.01,40.26 65.47,45.72 SV1.26
N$23
  Top 0.254: SV1.24 73.85,43.94 64.96,43.94 61.15,40.13 61.15,39.45 DEMUX2.5
N$24
  Top 0.254: SV1.22 72.07,43.18 65.47,43.18 62.42,40.13 62.42,39.45 DEMUX2.4
N$25
  Top 0.254: SV1.20 70.29,42.42 65.98,42.42 63.69,40.13 63.69,39.45 DEMUX2.3
N$26
  Top 0.254: SV1.18 68.52,41.66 66.48,41.66 64.96,40.13 64.96,39.19 | 64.96,39.19 64.96,38.61 | DEMUX2.2 64.96,39.19
N$27
  Top 0.254: SV1.16 74.11,33.02 68.26,27.18 66.23,27.18 65.22,28.19 65.22,29.13 DEMUX2.23
N$28
  Top 0.254: DEMUX2.22 63.69,29.13 63.69,28.45 65.72,26.42 70.55,26.42 SV1.14
N$29
  Top 0.254: SV1.12 72.33,25.65 65.22,25.65 62.67,28.19 62.67,29.13 DEMUX2.21
N$30
  Top 0.254: SV1.10 74.11,24.89 64.71,24.89 61.15,28.45 61.28,28.57 DEMUX2.20
N$31
  Top 0.254: DEMUX2.19 60.01,28.32 65.47,22.86 SV1.8
N$32
  Top 0.254: DEMUX2.18 58.74,28.32 66.74,20.32 SV1.6
N$33
  Top 0.254: DEMUX2.17 57.47,28.32 68.01,17.78 SV1.4
N$34
  Top 0.254: DEMUX2.16 56.2,28.32 69.28,15.24 SV1.2
N$36  (via drill 0.6)
  Top 0.254: v46.67,17.78 R19.2 | v36.51,31.11 35.24,29.84 33.02,29.84 32.38,30.48 32.38,35.62 IC1.43
  Bottom 0.254: v46.67,17.78 38.1,17.78 35.56,20.32 35.56,30.16 v36.51,31.11
N$37  (via drill 0.6)
  Top 0.254: IC1.42 33.34,35.47 v33.34,30.8 | v45.72,15.24 R18.2
  Bottom 0.254: v33.34,30.8 33.34,18.41 36.51,15.24 v45.72,15.24
N$38  (via drill 0.6)
  Top 0.254: R17.2 40.32,12.7 v36.2,16.83 | v34.29,31.75 33.96,32.08 IC1.41
  Bottom 0.254: v36.2,16.83 34.29,18.73 v34.29,31.75
N$39  (via drill 0.6)
  Top 0.254: v45.72,16.51 R16.2 | v35.24,32.7 34.76,33.19 IC1.40
  Bottom 0.254: v45.72,16.51 38.1,16.51 34.92,19.68 34.92,31.11 35.24,31.43 v35.24,32.7
N$40  (via drill 0.6)
  Top 0.254: IC1.26 42.22,28.25 42.86,28.89 v44.77,28.89 | v45.72,13.97 R15.2
  Bottom 0.254: v45.72,13.97 47.62,15.88 47.62,26.04 v44.77,28.89
N$41  (via drill 0.6)
  Top 0.254: IC1.25 42.37,27.45 42.55,27.62 v48.26,27.62 | v45.72,11.43 R14.2
  Bottom 0.254: v48.26,27.62 48.26,13.97 v45.72,11.43
N$44  (via drill 0.6)
  Top 0.254: IC1.44 31.56,37.34 v31.43,37.47 | v57.78,44.13 R20.2
  Top 0.406: R20.2 57.78,48.58
  Bottom 0.254: v31.43,37.47 51.12,37.47 v57.78,44.13
N$53
  Top 0.254: R24.2 52.7,44.77 44.45,36.51 44.45,33.66 43.04,32.24 IC1.31
N$54
  Top 0.254: R25.2 53.98,45.09 45.09,36.2 45.09,33.02 43.51,31.45 IC1.30
OLED1B
  Top 0.254: R16.1 57.15,16.51 59.37,14.29 59.37,4.45 SV4.15
OLED1G
  Top 0.254: SV4.13 56.83,4.45 56.83,13.34 56.2,13.97 R15.1
OLED1R
  Top 0.254: SV4.11 54.29,4.45 54.29,7.3 R14.1
OLED2B
  Top 0.254: SV4.16 60.64,14.61 57.47,17.78 R19.1
OLED2G
  Top 0.254: SV4.14 58.1,13.97 56.83,15.24 R18.1
OLED2R
  Top 0.254: SV4.12 55.56,12.06 R17.1
RESET
  Top 0.254: IC1.4 29.75,31.43 27.3,31.43 26.36,32.38 R1.1 24.45,33.02 21.27,36.2 J1.5
SCK  (via drill 0.6)
  Top 0.254: v56.52,46.67 R23.2 | J1.3 21.27,39.05 22.54,37.78 22.54,36.51 23.5,35.56 v25.72,35.56 25.72,34.29 27.76,32.24 IC1.3
  Bottom 0.254: v56.52,46.67 50.16,40.32 28.57,40.32 25.72,37.47 v25.72,35.56
STRING0
  Top 0.406: Q1.B R3.1 27.62,61.91 SV3.1 | Q1.B 24.45,61.77 | C8.1 24.13,61.45 Q1.B
STRING1
  Top 0.406: C9.1 42.23,62.38 Q2.B R5.1 38.41,61.91 SV3.2
STRING2
  Top 0.406: C10.1 24.13,54.78 Q3.B R7.1 SV3.3
STRING3
  Top 0.406: C11.1 42.23,55.71 Q4.B R9.1 SV3.4
STRING4
  Top 0.406: C12.1 24.13,48.11 Q5.B R11.1 27.62,48.58 SV3.5
STRING5
  Top 0.406: C13.1 42.23,49.04 Q6.B R13.1 38.42,48.58 SV3.6
STRINGLED0
  Top 0.254: SV1.33 75.88,57.15 58.42,57.15 57.78,56.52 R20.1
STRINGLED1
  Top 0.254: SV1.34 59.38,55.88 R21.1
STRINGLED2
  Top 0.254: SV1.35 75.88,59.69 57.47,59.69 55.24,57.47 R22.1
STRINGLED3
  Top 0.254: SV1.36 58.1,58.42 56.52,56.83 R23.1
STRINGLED4
  Top 0.254: SV1.37 75.88,62.23 56.2,62.23 52.7,58.74 R24.1
STRINGLED5
  Top 0.254: SV1.38 56.83,60.96 53.98,58.1 R25.1
USBDM
  Top 0.254: X1.D- 24.84,21.83 23.81,22.86 22.23,22.86 20.95,21.59 20.95,16.51 22.54,14.92 22.54,13.34 20.64,11.43 20.64,10.48 20.87,10.24 IC2.16
USBDP
  Top 0.254: X1.D+ 21.59,19.98 21.59,16.83 23.18,15.24 23.18,12.7 21.77,11.3 IC2.15
VCC  (via drill 0.6)  (3 unrouted)
  Top 0.254: IC1.17 35.56,20.32 36.51,19.37 C6.1 40.64,16.19 v42.86,13.97 | DEMUX1.24 84.4,39.32 v82.87,37.78 79.38,34.29 72.39,34.29 67.36,29.26 DEMUX2.24 66.36,30.16 65.4,31.12 C7.1 47.94,29.84 42.86,29.84 42.06,29.05 IC1.27 35.56,29.05 IC1.17 | v28.89,52.7 R11.2 | v28.89,63.82 R3.2 | R7.2 v28.89,57.15 | Q6.E 37.46,46.67 v36.83,47.31 | v36.83,57.15 R5.2 | R9.2 v36.83,53.34 | IC1.17 35.56,28.7 | 35.22,29.05 32.87,29.05 31.27,30.64 IC1.5 24.61,30.64 R1.2 v22.23,30.48 | 35.08,29.05 35.9,29.05 | C4.1 31.38,4.39 IC2.4 28.97,4.45 26.99,4.45 v26.04,5.4 23.79,7.64 IC2.20 19.39,7.64 C3.1 | C2.1 25.18,18.73 X1.VBUS
  Top 0.406: R3.2 Q1.E | R7.2 Q3.E | R11.2 Q5.E | Q6.E R13.2 | R9.2 Q4.E
  Bottom 0.254: v82.87,37.78 79.06,41.59 79.06,61.59 SV1.39 | 28.89,47.31 28.89,47.62 | 28.89,47.62 v28.89,52.7 v28.89,57.15 v28.89,63.82 | v36.83,57.15 v36.83,53.34 v36.83,47.31 29.21,47.31 | 28.89,47.31 29.21,47.31 | 28.89,47.62 29.21,47.31 | SV4.2 v42.86,13.97 | 28.89,47.31 J1.2 22.54,43.5 20.64,43.5 20,42.86 20,32.7 v22.23,30.48 26.67,26.04 26.67,20.26 X1.VBUS 26.04,17.56 v26.04,5.4